# EAGLE design Light (EAGLE 6.3)
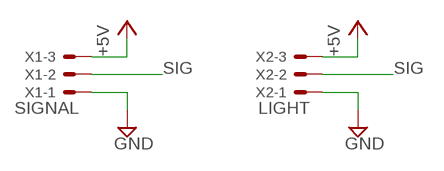
[diagram p0: schematic, sheet 1]

## Parts
X1  SIGNAL  22-23-2031  [22-23-2031]
X2  LIGHT  22-23-2031  [22-23-2031]

## Nets
+5V: X1.3 X2.3
GND: X1.1 X2.1
SIG: X1.2 X2.2

## Library data of the parts
X1 X2 = con-molex:22-23-2031: .100" (2.54mm) Center Header - 3 Pin; MF: MOLEX; MPN: 22-23-2031; OC_FARNELL: 1462950; OC_NEWARK: 30C0862

## Net classes
0 default: width 0.254 mm, clearance 0.254 mm

## Board
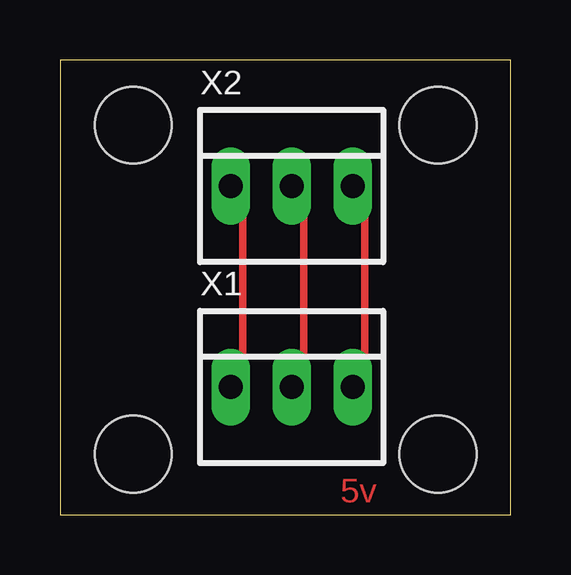
[diagram p1: board, top side]

Size 18.78 x 18.97 mm. Coordinates in mm from the lower left corner, seen from the top.
Outline: 0,0 18.78,0 18.78,18.97 0,18.97 0,0
Copper layers (1*16): Top 0.035mm / dielectric 1.5mm / Bottom 0.035mm
Design rules "CUSTOM": minimum track width 12mil, minimum drill 20mil, track to track 12mil, track to pad 12mil, pad to pad 12mil, via to via 8mil, smd to smd 8mil, copper to edge 12mil, drill to drill 12mil, minimum pad ring 12mil, minimum via ring 12mil, stop-mask expansion 4mil, vias tented up to drill 25mil, thermal gap 10mil
Holes 3.2 mm at 3.05,16.26 3.05,2.54 15.75,16.26 15.75,2.54

### Footprints (pad centres in the part's own frame; a part is rotated, then mirrored left to right if it is on the bottom)
22-23-2031 = drill 1 long: 1 -2.54,0; 2 0,0; 3 2.54,0

### Placement (x,y rotation side)
X1  9.65,5.33 0 top
X2  9.65,13.72 0 top

### Tracks (layer width: path | path; a pad name or v marks a point on that pad's centre or on a via)
+5V
  Top 0.305: X1.3 12.7,6.35 12.7,12.7 X2.3
GND
  Top 0.305: X1.1 7.62,6.35 7.62,12.7 X2.1
SIG
  Top 0.305: X1.2 10.16,6.35 10.16,12.7 X2.2

### Text on the board
Top: 5v